# EAGLE design touch_controller (EAGLE 8.2.2)
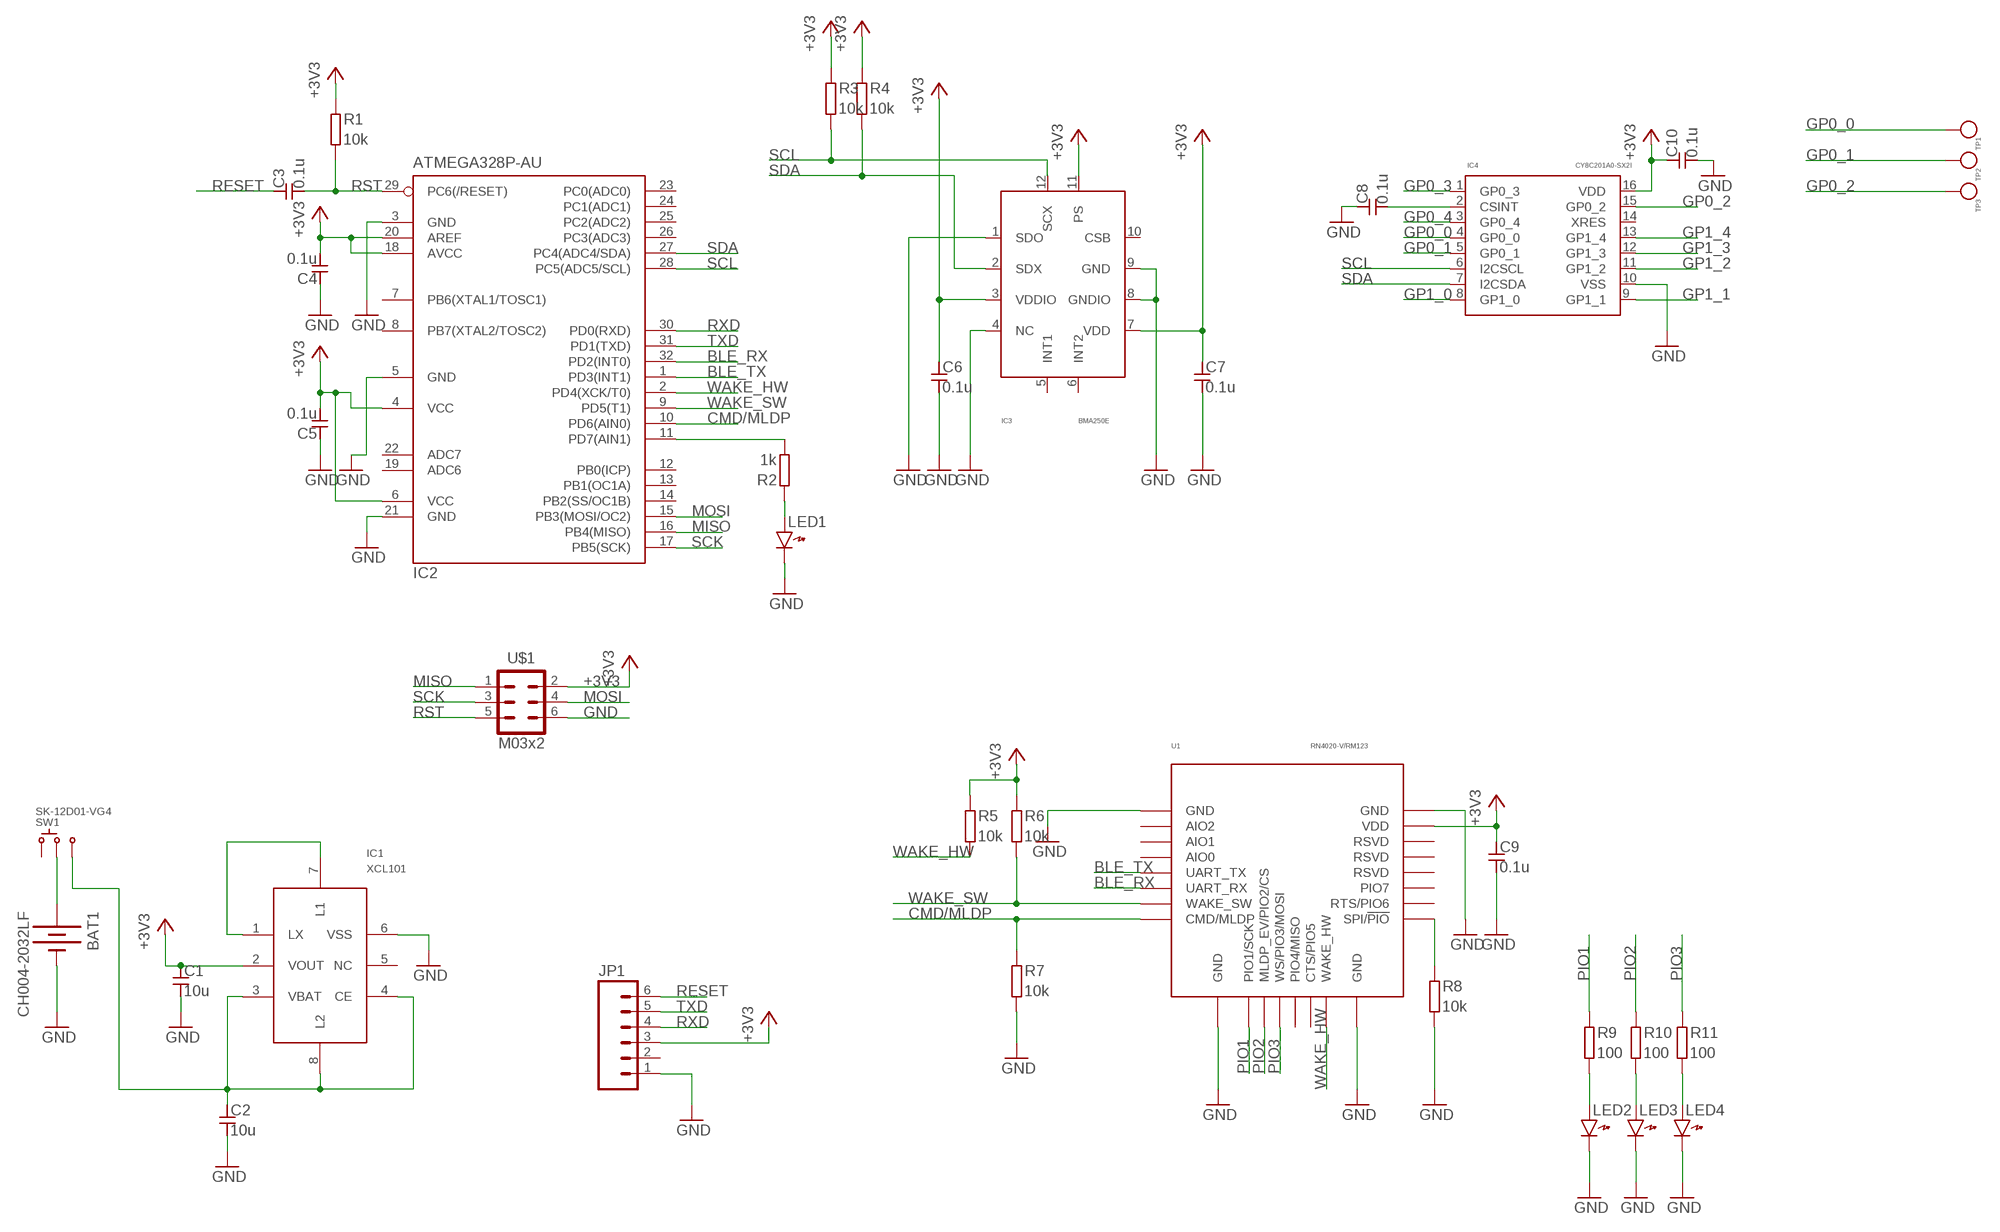
[diagram p0: schematic, sheet 1]

## Parts
BAT1  CH004-2032LF  [CH004-2032LF]
C1  10u  CAPACITOR2012_REDUCED  [SMD2012_REDUCED]
C2  10u  CAPACITOR2012_REDUCED  [SMD2012_REDUCED]
C3  0.1u  CAPACITOR1608_REDUCED  [SMD1608_REDUCED]
C4  0.1u  CAPACITOR1608_REDUCED  [SMD1608_REDUCED]
C5  0.1u  CAPACITOR1608_REDUCED  [SMD1608_REDUCED]
C6  0.1u  CAPACITOR1608_REDUCED  [SMD1608_REDUCED]
C7  0.1u  CAPACITOR1608_REDUCED  [SMD1608_REDUCED]
C8  0.1u  CAPACITOR1608_REDUCED  [SMD1608_REDUCED]
C9  0.1u  CAPACITOR1608_REDUCED  [SMD1608_REDUCED]
C10  0.1u  CAPACITOR1608_REDUCED  [SMD1608_REDUCED]
IC1  XCL101  [CL-2025]
IC2  ATMEGA328P-AU  [TQFP32-08]
IC3  BMA250E  [LGA-12]
IC4  CY8C201A0-SX2I  [SOIC-16]
JP1  M06NOSILK  [1X06-NOSILK]
LED1  LED1608_REDUCED  [LED1608_REDUCED]
LED2  LED1608_REDUCED  [LED1608_REDUCED]
LED3  LED1608_REDUCED  [LED1608_REDUCED]
LED4  LED1608_REDUCED  [LED1608_REDUCED]
R1  10k  RESISTOR1608_REDUCED  [SMD1608_REDUCED]
R2  1k  RESISTOR1608_REDUCED  [SMD1608_REDUCED]
R3  10k  RESISTOR1608_REDUCED  [SMD1608_REDUCED]
R4  10k  RESISTOR1608_REDUCED  [SMD1608_REDUCED]
R5  10k  RESISTOR1608_REDUCED  [SMD1608_REDUCED]
R6  10k  RESISTOR1608_REDUCED  [SMD1608_REDUCED]
R7  10k  RESISTOR1608_REDUCED  [SMD1608_REDUCED]
R8  10k  RESISTOR1608_REDUCED  [SMD1608_REDUCED]
R9  100  RESISTOR1608_REDUCED  [SMD1608_REDUCED]
R10  100  RESISTOR1608_REDUCED  [SMD1608_REDUCED]
R11  100  RESISTOR1608_REDUCED  [SMD1608_REDUCED]
SW1  SK-12D01-VG4  [SK-12D01-VG4]
TP1  HT-0720-10  [HT-0720-10]
TP2  HT-0720-10  [HT-0720-10]
TP3  HT-0720-10  [HT-0720-10]
U1  RN4020-V/RM123  [RN4020]
U$1  M03X2STD  [2X03]

## Nets
+3V3: C1.1 C4.2 C5.2 C6.1 C7.1 C9.1 C10.1 IC1.2(VOUT) IC2.4(VCC) IC2.6(VCC) IC2.18(AVCC) IC2.20(AREF) IC3.3(VDDIO) IC3.7(VDD) IC3.11(PS) IC4.16(VDD) JP1.3 R1.1 R3.1 R4.1 R5.1 R6.1 U1.23(VDD) U$1.2
BLE_RX: IC2.32(PD2(INT0)) U1.6(UART_RX)
BLE_TX: IC2.1(PD3(INT1)) U1.5(UART_TX)
CMD/MLDP: IC2.10(PD6(AIN0)) R7.1 U1.8(CMD/MLDP)
GND: BAT1.- C1.2 C2.2 C4.1 C5.1 C6.2 C7.2 C8.1 C9.2 C10.2 IC1.6(VSS) IC2.3(GND) IC2.5(GND) IC2.21(GND) IC3.1(SDO) IC3.4(NC) IC3.8(GNDIO) IC3.9(GND) IC4.10(VSS) JP1.1 LED1.K LED2.K LED3.K LED4.K R7.2 R8.2 U1.1(GND) U1.9(GND) U1.16(GND) U1.24(GND) U$1.6
GP0_0: IC4.4(GP0_0) TP1.P$1
GP0_1: IC4.5(GP0_1) TP2.P$1
GP0_2: IC4.15(GP0_2) TP3.P$1
GP0_3: IC4.1(GP0_3)
GP0_4: IC4.3(GP0_4)
GP1_0: IC4.8(GP1_0)
GP1_1: IC4.9(GP1_1)
GP1_2: IC4.11(GP1_2)
GP1_3: IC4.12(GP1_3)
GP1_4: IC4.13(GP1_4)
MISO: IC2.16(PB4(MISO)) U$1.1
MOSI: IC2.15(PB3(MOSI/OC2)) U$1.4
N$1: BAT1.+ SW1.2
N$2: C8.2 IC4.2(CSINT)
N$12: R8.1 U1.17(SPI/!PIO)
N$13: IC2.11(PD7(AIN1)) R2.2
N$14: LED2.A R9.2
N$15: LED3.A R10.2
N$16: LED4.A R11.2
N$17: LED1.A R2.1
N$18: C2.1 IC1.3(VBAT) IC1.4(CE) IC1.8(L2) SW1.3
N$20: IC1.1(LX) IC1.7(L1)
PIO1: R9.1 U1.10(PIO1/SCK)
PIO2: R10.1 U1.11(MLDP_EV/PIO2/CS)
PIO3: R11.1 U1.12(WS/PIO3/MOSI)
RESET: C3.1 JP1.6
RST: C3.2 IC2.29(PC6(/RESET)) R1.2 U$1.5
RXD: IC2.30(PD0(RXD)) JP1.4
SCK: IC2.17(PB5(SCK)) U$1.3
SCL: IC2.28(PC5(ADC5/SCL)) IC3.12(SCX) IC4.6(I2CSCL) R3.2
SDA: IC2.27(PC4(ADC4/SDA)) IC3.2(SDX) IC4.7(I2CSDA) R4.2
TXD: IC2.31(PD1(TXD)) JP1.5
WAKE_HW: IC2.2(PD4(XCK/T0)) R5.2 U1.15(WAKE_HW)
WAKE_SW: IC2.9(PD5(T1)) R6.2 U1.7(WAKE_SW)
Unconnected: IC1.5(NC) IC2.7(PB6(XTAL1/TOSC1)) IC2.8(PB7(XTAL2/TOSC2)) IC2.12(PB0(ICP)) IC2.13(PB1(OC1A)) IC2.14(PB2(SS/OC1B)) IC2.19(ADC6) IC2.22(ADC7) IC2.23(PC0(ADC0)) IC2.24(PC1(ADC1)) IC2.25(PC2(ADC2)) IC2.26(PC3(ADC3)) IC3.5(INT1) IC3.6(INT2) IC3.10(CSB) IC4.14(XRES) JP1.2 SW1.1 U1.2(AIO2) U1.3(AIO1) U1.4(AIO0) U1.13(PIO4/MISO) U1.14(CTS/PIO5) U1.18(RTS/PIO6) U1.19(PIO7) U1.20(RSVD) U1.21(RSVD) U1.22(RSVD)

## Library data of the parts
BAT1 = battery:CH004-2032LF: CR2032 x 1 akizuki : P-11255
C1-C10 = generic:CAPACITOR: Generic Capacitor
IC1 = DCDC:XCL101
IC2 = AVR:ATMEGA328P-AU: AVR ATMEGA328P-AU AKIZUKI CODE I-04386
IC3 = acceleration_sensor:BMA250E: Bosch Triaxial Acceleraration Sensor 2g,4g,8g,16g 3-wire,4-wire,I2C,SPI 1.2V ~ 3.6V
IC4 = touch_sensor:CY8C201A0: Cypress touch sensor
JP1 = header:M06
LED1-LED4 = generic:LED: Generic LEDs
R1-R11 = generic:RESISTOR: Generic Registor
SW1 = switch:SK-12D01-VG4: Slide switch ON-(ON) akizuki: P-08789
TP1-TP3 = test_pin:HT-0720-10
U1 = com_module:RN4020: Bluetooth Low Energy Module Microchip
U$1 = header:M03X2

## Board
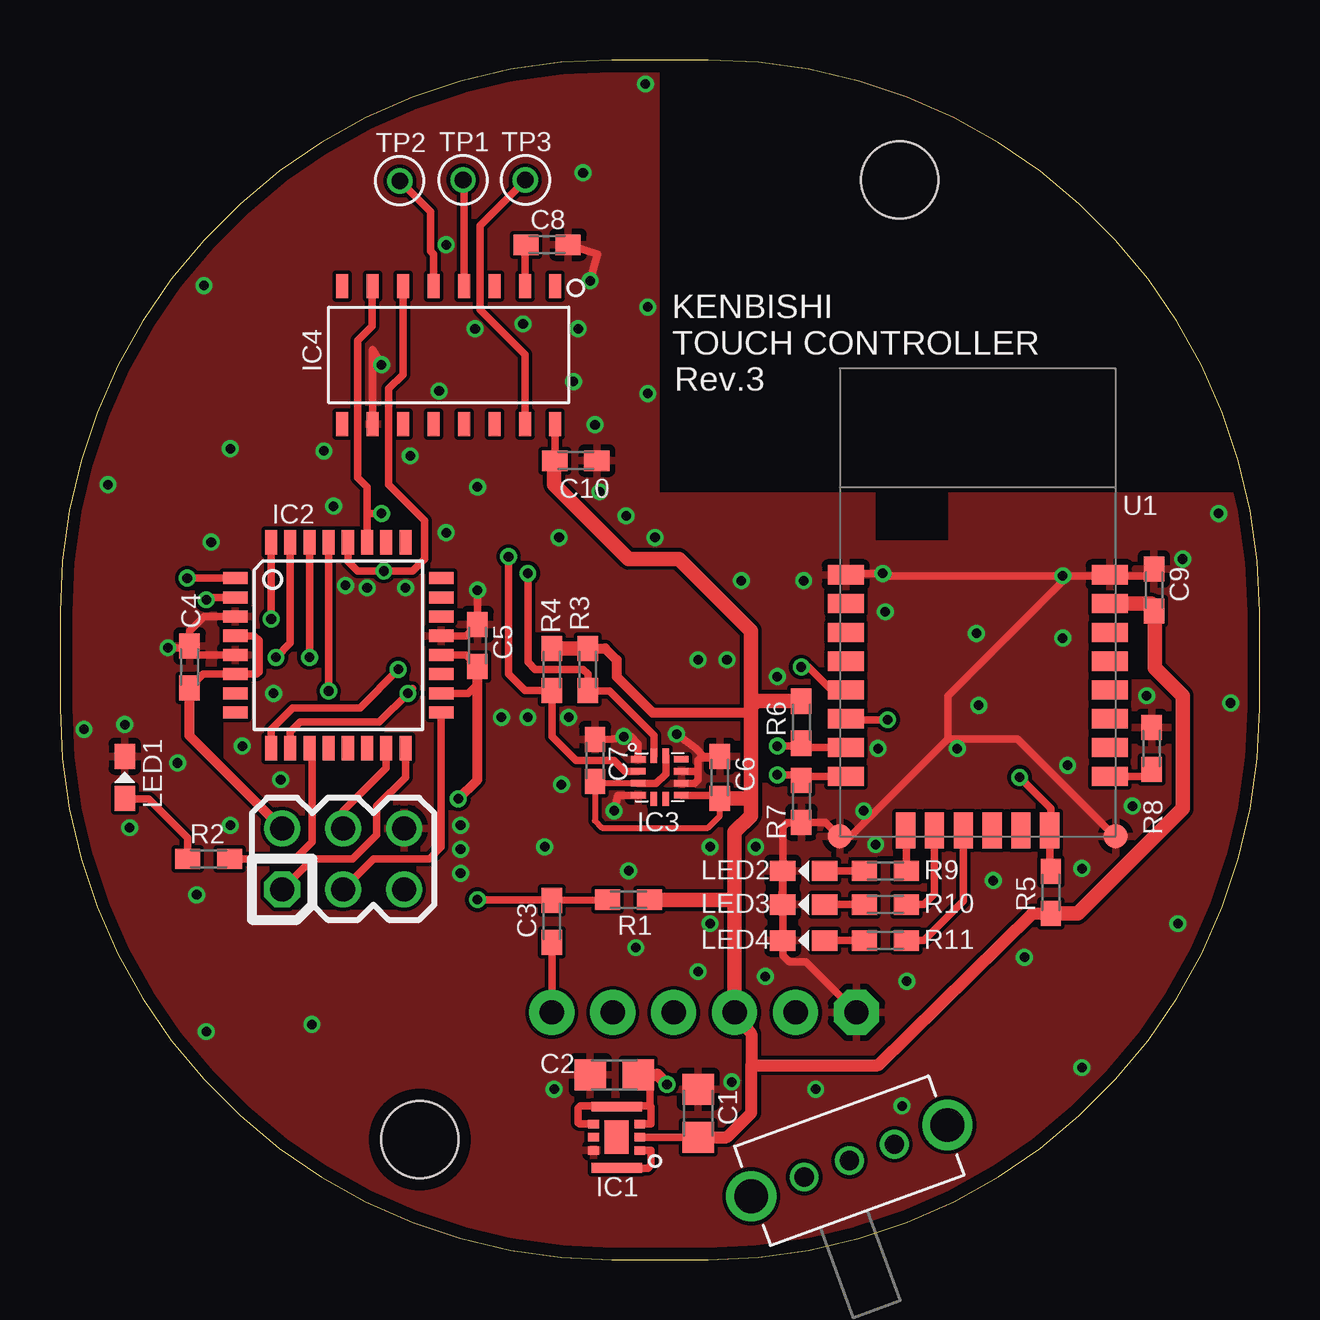
[diagram p1: board, top side]
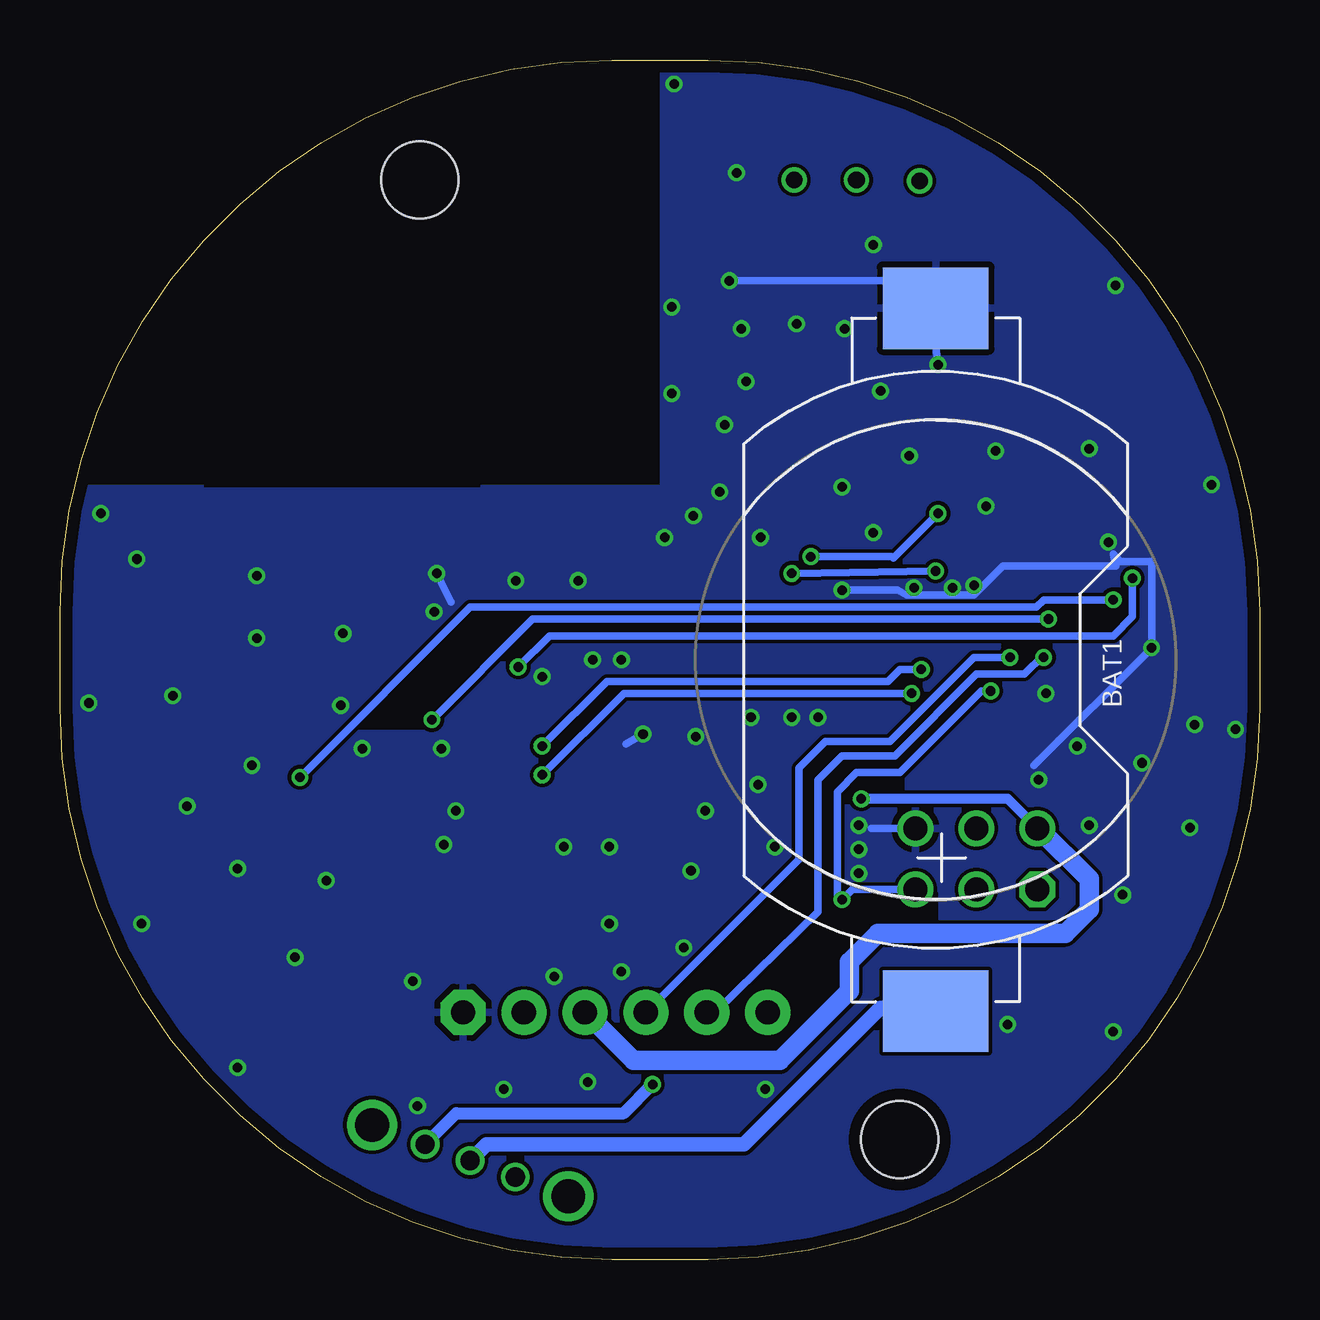
[diagram p2: board, bottom side, seen from below]

Size 50 x 50 mm. Coordinates in mm from the lower left corner, seen from the top.
Outline: 0,27 0,23 arc90 23,0 27,0 arc90 50,23 50,27 arc90 27,50 23,50 arc90 0,27
Copper layers (1*16): Top 0.035mm / dielectric 1.6mm / Bottom 0.035mm
Design rules "Elecrow_2-layer_PCB_eagle_rule": minimum track width 6mil, minimum drill 12mil, track to track 6mil, track to pad 6mil, pad to pad 6mil, via to via 8mil, smd to smd 0mil, copper to edge 20mil, drill to drill 10mil, minimum pad ring 6mil, minimum via ring 6mil, stop-mask expansion 0mil, vias tented up to drill 100mil, thermal gap 10mil
Holes 3.2 mm at 35,45 15,5
tRestrict: area 25,32 to 58,50; area 34,30 to 37,32; area 44.5,24.2 to 45.5,24.3; area 34.1,16.6 to 34.6,16.8; area 34.2,12.8 to 34.6,12.9; area 21,23.1 to 21.5,23.2; area 6.6,21.1 to 6.8,22.4; area 24.5,18.2 to 24.6,18.8; area 9.7,14.6 to 14.2,14.7; area 12.8,34 to 13.2,34.3; area 14,18.8 to 14.8,18.9
bRestrict: area 25,32.3 to 57.9,49.9; area 17.6,14.5 to 18.3,14.6; area 34.7,22.8 to 34.9,24.8; area 34.7,22.1 to 37.4,22.2; area 13.4,14.1 to 13.5,15.3; area 14.8,19.6 to 15,20

### Footprints (pad centres in the part's own frame; a part is rotated, then mirrored left to right if it is on the bottom)
CH004-2032LF = smd 3.4 x 4.4: + -14.65,0; - 14.65,0
SMD2012_REDUCED = smd 1.3 x 1.3: 1 -1,0; 2 1,0
SMD1608_REDUCED = smd 1.05 x 0.85: 1 -0.875,0; 2 0.875,0
CL-2025 = smd 0.35 x 0.44: 1 -0.55,-0.96; 2 0,-0.96; 3 0.55,-0.96; 4 0.55,0.96; 5 0,0.96; 6 -0.55,0.96 | smd 0.4 x 2.1: 7 -1.275,0; 8 1.275,0 | smd 1.4 x 1: P$1 0,0
TQFP32-08 = smd 1.016 x 0.508: 1 -4.293,2.8; 2 -4.293,2; 3 -4.293,1.2; 4 -4.293,0.4; 5 -4.293,-0.4; 6 -4.293,-1.2; 7 -4.293,-2; 8 -4.293,-2.8; 17 4.293,-2.8; 18 4.293,-2; 19 4.293,-1.2; 20 4.293,-0.4; 21 4.293,0.4; 22 4.293,1.2; 23 4.293,2; 24 4.293,2.8 | smd 0.508 x 1.016: 9 -2.8,-4.293; 10 -2,-4.293; 11 -1.2,-4.293; 12 -0.4,-4.293; 13 0.4,-4.293; 14 1.2,-4.293; 15 2,-4.293; 16 2.8,-4.293; 25 2.8,4.293; 26 2,4.293; 27 1.2,4.293; 28 0.4,4.293; 29 -0.4,4.293; 30 -1.2,4.293; 31 -2,4.293; 32 -2.8,4.293
LGA-12 = smd 0.6 x 0.28: 1 -0.9,0.75; 2 -0.9,0.25; 3 -0.9,-0.25; 4 -0.9,-0.75; 7 0.9,-0.75; 8 0.9,-0.25; 9 0.9,0.25; 10 0.9,0.75 | smd 0.28 x 0.6: 5 -0.25,-0.9; 6 0.25,-0.9; 11 0.25,0.9; 12 -0.25,0.9
SOIC-16 = smd 0.5 x 1: 1 -4.445,-2.875; 2 -3.175,-2.875; 3 -1.905,-2.875; 4 -0.635,-2.875; 5 0.635,-2.875; 6 1.905,-2.875; 7 3.175,-2.875; 8 4.445,-2.875; 9 4.445,2.875; 10 3.175,2.875; 11 1.905,2.875; 12 0.635,2.875; 13 -0.635,2.875; 14 -1.905,2.875; 15 -3.175,2.875; 16 -4.445,2.875
1X06-NOSILK = drill 1.016 pad 1.88 octagon: 1 0,0 | drill 1.016 pad 1.88: 2 2.54,0; 3 5.08,0; 4 7.62,0; 5 10.16,0; 6 12.7,0
LED1608_REDUCED = smd 1.05 x 0.85: A -0.875,0; K 0.875,0
SK-12D01-VG4 = drill 0.8: 1 -2,0; 2 0,0; 3 2,0 | drill 1.4: 4 4.35,0; 5 -4.35,0
HT-0720-10 = drill 0.7: P$1 0,0
RN4020 = smd 1.5 x 0.8: 1 0.25,10.9; 2 0.25,9.7; 3 0.25,8.5; 4 0.25,7.3; 5 0.25,6.1; 6 0.25,4.9; 7 0.25,3.7; 8 0.25,2.5; 17 11.25,2.5; 18 11.25,3.7; 19 11.25,4.9; 20 11.25,6.1; 21 11.25,7.3; 22 11.25,8.5; 23 11.25,9.7; 24 11.25,10.9 | smd 1 x 1: 9 0,0; 16 11.5,0 | smd 0.8 x 1.5: 10 2.75,0.25; 11 3.95,0.25; 12 5.15,0.25; 13 6.35,0.25; 14 7.55,0.25; 15 8.75,0.25
2X03 = drill 1 octagon: 1 -1.27,2.54 | drill 1: 2 1.27,2.54; 3 -1.27,0; 4 1.27,0; 5 -1.27,-2.54; 6 1.27,-2.54

### Placement (x,y rotation side)
BAT1  13.5,25 90 bottom
C1  26.6,6.1 90 top
C2  23.1,7.7 180 top
C3  20.5,14.1 90 top
C4  5.4,24.7 270 top
C5  17.4,25.6 270 top
C6  27.5,20.1 90 top
C7  22.3,20.8 90 top
C8  20.3,42.3 180 top
C9  45.6,27.91 90 top
C10  21.5,33.3 0 top
IC1  23.2,5.1 90 top
IC2  11.6,25.6 0 top
IC3  25,20.1 0 top
IC4  16.2,37.7 180 top
JP1  33.2,10.3 180 top
LED1  2.7,20.1 90 top
LED2  31,16.2 180 top
LED3  31,14.8 180 top
LED4  31,13.3 180 top
R1  23.7,15 180 top
R2  6.2,16.7 0 top
R3  22,24.6 270 top
R4  20.5,24.6 270 top
R5  41.3,15.3 90 top
R6  30.9,22.4 270 top
R7  30.9,19.1 270 top
R8  45.5,21.3 90 top
R9  34.4,16.2 180 top
R10  34.4,14.8 180 top
R11  34.4,13.3 180 top
SW1  32.9,4.12 20 top
TP1  16.8,45 0 top
TP2  14.16,44.96 0 top
TP3  19.4,45 0 top
U1  32.5,17.64 0 top
U$1  11.8,16.7 90 top

### Tracks (layer width: path | path; a pad name or v marks a point on that pad's centre or on a via)
+3V3  (via drill 0.4)
  Top 0.254: IC3.3 22.38,19.85 C7.1 22.3,18.3 22.6,18 27,18 27.5,18.5 C6.1
  Top 0.305: 43.77,27.34 U1.23 | 45.63,27 C9.1 | IC3.7 27.18,19.35 C6.1 | IC3.11 25.25,20.25 24.85,19.85 IC3.3 | C4.2 5.97,24.4 IC2.6 8.2,24.4 8.3,24.5 8.3,25.8 8.1,26 IC2.4 | IC2.20 16.93,25.2 C5.2 17.4,24 17,23.6 IC2.18 | 28.1,10.48 JP1.3 | 20.91,33.09 arc45 C10.1 20.64,33.32 IC4.16 | IC1.2 C1.1
  Top 0.406: R3.1 22.73,25.48 23.2,25 23.2,24.3 24.7,22.8 28.75,22.8 28.8,22.75 | U$1.2 5.4,21.83 C4.2 | v16.6,19.2 17.4,20 C5.2
  Top 0.508: 28.82,8.1 34.1,8.1 40.52,14.43 R5.1 | JP1.3 28.82,9.4 28.82,8.1 | C1.1 27.8,5.1 28.82,6.12 28.82,8.1
  Top 0.61: R5.1 42.42,14.43 46.8,18.8 46.8,23.5 45.63,24.66 45.63,27 | 43.8,27.3 43.77,27.34 | C9.1 45.49,27.34 U1.23 | R4.1 R3.1 | 30.88,23.3 R6.1 29.02,23.27 28.8,23.05 | 28.12,14.92 JP1.3 | 28.12,14.92 28.12,17.82 28.8,18.5 28.8,19.75 | 28.8,19.75 28.8,22.75 28.8,23.05 | 28.8,23.05 28.8,26.2 25.8,29.2 23.7,29.2 20.6,32.3 20.6,33.27 C10.1 | C6.1 28.78,19.23 28.8,19.75 | R1.1 28.04,15 28.12,14.92
  Bottom 0.305: JP1.3 28.12,10.12 | 9.23,18 U$1.2
  Bottom 0.406: U$1.2 10.49,19.2 v16.6,19.2
  Bottom 0.813: JP1.3 28.1,10.3 26.1,8.3 20,8.3 17.1,11.2 17.1,12.4 15.9,13.6 8.1,13.6 7.1,14.6 7.1,15.87 9.23,18
BLE_RX  (via drill 0.4)
  Top 0.305: v34.5,22.5 32.79,22.5 U1.6 | IC2.32 v8.8,26.7
  Bottom 0.305: v8.8,26.7 30.3,26.7 v34.5,22.5
BLE_TX  (via drill 0.4)
  Top 0.305: v30.9,24.7 31.2,24.7 32.2,23.7 32.71,23.7 U1.5 | IC2.1 v5.3,28.4
  Bottom 0.305: v5.3,28.4 5.3,26.8 6.1,26 29.6,26 v30.9,24.7
CMD/MLDP  (via drill 0.4)
  Top 0.305: U1.8 31.07,20.14 R7.1 | 30.88,19.6 R7.1 | IC2.10 9.6,22 10,22.4 13.3,22.4 v14.5,23.6 14.7,23.8 | R7.1 30.7,20.2 v29.9,20.2
  Bottom 0.305: v14.5,23.6 26.5,23.6 v29.9,20.2
GND  (via drill 0.4)
  Top 0.305: C9.2 45.59,28.48 44.7,28.5 43.79,28.5 U1.24 43.71,28.5 42,28.5 | LED2.K LED3.K LED4.K 30.12,12.68 30.4,12.4 31.1,12.4 JP1.1 | IC3.8 26.45,19.85 26.6,20 26.6,20.27 | 26.6,20.27 26.6,20.8 26.7,20.9 27.23,20.9 C6.2 26.8,21 26.5,21.3 v25.7,21.9 | IC3.9 26.52,20.35 26.6,20.27 | R7.2 30.88,17.9 30.9,17.9 R7.2 | 30.1,15.3 30.1,14.43 LED2.K | 32.36,17.64 U1.9 | R7.2 31.91,18.23 U1.9 | IC2.5 5.78,25.2 C4.1 | IC2.21 16.93,26 C5.1 v17.4,27.9 | IC2.3 6,26.8 5.4,26.2 C4.1 | IC3.1 24.1,21.5 23.8,21.8 23.02,21.7 C7.2 | IC3.4 23.25,19.35 v23.1,18.7 | U1.1 32.81,28.6 v34.3,28.6 34.4,28.5 v41.8,28.5 42,28.5 | U1.9 32.94,17.64 37,21.7 | 37,21.7 37,23.5 42,28.5 | U1.16 43.96,17.64 39.9,21.7 37,21.7 | LED2.K 30.12,18.02 30.3,18.2 30.88,18.2 R7.2 | IC4.10 13.03,37.92 v13.4,37.3 | C8.1 22.4,41.9 v22.1,40.8 | v4.5,25.5 5.33,25.5 C4.1
  Bottom 0.305: 33.7,27.4 v34.3,28.6 | v13.4,37.3 13.7,39.9 13.6,40 13.6,40.65 13.53,40.72 | 13.53,40.72 BAT1.- | v22.1,40.8 14.71,40.8 13.53,40.72 | v17.4,27.9 15.1,27.9 14.7,27.7 11.9,27.7 10.7,28.9 6,28.9 6.1,29.4 5.8,29.1 4.5,29.1 v4.5,25.5 9.4,20.6 | U$1.6 16.17,17.97 | v25.7,21.9 26.4,21.5
  other vias: 24.4,49 22.3,34.8 44.7,18.9 23.5,21.8 45.3,23.5 16.7,18.1 16.7,17.1 16.7,16.1 8.9,23.6 11.9,28.1 12.8,28 14.4,28 21.2,22.6 19.5,22.6 18.4,22.6 20.9,19.8 20.2,17.2 23.7,16.2 27.1,17.2 29,17.2 29.9,24.3 34.1,21.3 33.5,18.7 34,17.3 37.4,21.3 38.3,23.1 38.2,26.1 34.4,27 41.8,25.9 42,20.6 42.6,16.3 38.9,15.8 35.3,11.6 40.2,12.6 42.6,8 29.4,11.8 26.6,12 27.1,14 24,13 31,28.3 28.4,28.3 24.8,30.1 23.6,31 22.5,32 24.5,36.1 21.4,36.6 21.6,38.8 24.5,39.7 19.3,39 15.8,36.2 17.4,32.2 14.6,33.5 21.8,45.3 16.1,42.3 11,33.7 7.1,33.8 6,40.6 2,32.3 1,22.1 7.6,21.4 9.2,20 7.1,18.1 2.7,22.3 6.1,9.5 10.5,9.8 20.6,7.1 28,7.4 31.5,7.1 35.1,6.4 46.6,14 48.8,23.2 48.3,31.1 6.3,29.9 11.4,31.4 16.1,30.3 4.9,20.7 20.8,30.1 26.6,25 27.8,25 2.9,18 17.3,38.8 5.7,15.2 46.8,29.2
  pour Bottom: 0,0 50,0 50,50 0,50
  pour Top: 0,0 50,0 50,50 0,50
GP0_0
  Top 0.305: IC4.4 16.84,44.97 TP1.P$1
GP0_1
  Top 0.305: IC4.5 15.56,41.91 15.44,42.03 15.44,43.68 TP2.P$1
GP0_2
  Top 0.305: IC4.15 19.38,37.73 17.5,39.6 17.5,43.1 TP3.P$1
MISO
  Top 0.305: IC2.16 14.4,20.1 13.2,18.9 13.2,17.7 12.2,16.7 10.53,16.7 U$1.1
MOSI
  Top 0.305: IC2.15 13.6,20.5 11.8,18.7 U$1.4
N$1
  Bottom 0.61: SW1.2 32.23,4.8 21.5,4.8 15.8,10.5 14.1,10.5 14,10.4 13.55,10.4 BAT1.+
N$2
  Top 0.305: 19.38,40.75 IC4.2 19.38,41.85 C8.2
N$12
  Top 0.305: U1.17 45.44,20.14 R8.1
N$13
  Top 0.305: IC2.11 10.4,21 10.5,20.9 10.5,17.4 9.8,16.7 R2.2
N$14
  Top 0.305: LED2.A R9.2
N$15
  Top 0.305: R10.2 LED3.A
N$16
  Top 0.305: LED4.A R11.2
N$17
  Top 0.305: R2.1 5.33,17.57 3.7,19.2 2.92,19.2 LED1.A
N$18  (via drill 0.4)
  Top 0.305: 24.6,6.4 23.23,6.4 IC1.8 23.18,6.4 21.7,6.4 21.6,6.3 21.6,5.7 21.65,5.65 IC1.4 | IC1.3 24.64,5.65 24.64,6.36 24.6,6.4 | 24.6,6.4 24.6,7.6 C2.1
  Top 0.508: v25.3,7.3 24.9,7.7 C2.1
  Bottom 0.508: SW1.3 33.49,6.1 26.5,6.1 v25.3,7.3
N$20
  Top 0.305: IC1.1 24.64,4.55 24.64,3.94 24.5,3.8 23.23,3.8 IC1.7
PIO1
  Top 0.305: U1.10 35.27,17.86 R9.1
PIO2
  Top 0.305: U1.11 36.45,15.25 36,14.8 R10.1
PIO3
  Top 0.305: U1.12 37.65,14.95 36,13.3 R11.1
RESET
  Top 0.305: JP1.6 C3.1
RST  (via drill 0.4)
  Top 0.305: C3.2 R1.2 | 20.6,15.07 C3.2 | v17.4,15 20.48,15 C3.2 | v11.2,23.7 IC2.29
  Bottom 0.305: U$1.5 16.97,15.43 v17.4,15 17.6,15.2 17.6,19.5 16.8,20.3 15,20.3 11.6,23.7 v11.2,23.7
RXD  (via drill 0.4)
  Top 0.305: IC2.30 v10.4,25.1
  Bottom 0.305: v10.4,25.1 11.9,25.1 15.4,21.6 18.1,21.6 19.2,20.5 19.2,16.68 JP1.4 25.6,10.32
SCK
  Top 0.305: IC2.17 15.89,17.19 15.4,16.7 13.07,16.7 U$1.3
SCL  (via drill 0.4)
  Top 0.305: IC2.28 12,29.1 12.4,28.7 v13.5,28.7 14.7,28.7 15.2,29.2 15.2,30.8 13.7,32.3 13.7,36.3 14.29,36.9 IC4.6 | 19.5,28.7 v19.5,28.6 19.5,24.9 19.8,24.6 21.8,24.6 22,24.4 R3.2 22.02,23.7 22.9,23.7 24.75,21.85 IC3.12
  Bottom 0.305: v19.5,28.6 v13.5,28.7
SDA  (via drill 0.4)
  Top 0.305: 12.8,31.09 IC2.27 | 12.8,31.09 12.8,32.2 12.4,32.6 12.4,38.3 13,38.9 13,40.55 IC4.7 | v13.4,31.1 12.8,31.1 12.8,31.09 | IC3.2 23.55,20.35 23.1,20.8 21.5,20.8 20.5,21.8 R4.2 19.38,23.73 18.7,24.4 v18.7,29.3
  Bottom 0.305: v13.4,31.1 15.27,29.23 15.34,29.3 v18.7,29.3
TXD  (via drill 0.4)
  Top 0.305: IC2.31 9.6,25.7 v9,25.1
  Bottom 0.305: v9,25.1 9,25.2 9.8,24.4 11.8,24.4 15.2,21 17.4,21 18.4,20 18.4,14.5 22.66,10.34 23,10.34 JP1.5
WAKE_HW  (via drill 0.4)
  Top 0.305: R5.2 41.25,16.23 U1.15 41.3,17.94 41.3,18.8 v40,20.1 | IC2.2 6.3,27.6 v6.1,27.5
  Bottom 0.305: v6.1,27.5 9,27.5 9.3,27.2 32.9,27.2 v40,20.1
WAKE_SW  (via drill 0.4)
  Top 0.305: U1.7 31.09,21.34 R6.2 | R6.2 30.77,21.4 v29.9,21.4 | 30.88,21.5 R6.2 | IC2.9 8.8,22.1 9.7,23 12.5,23 v14.1,24.6
  Bottom 0.305: v14.1,24.6 15,24.6 15.5,24.1 27.2,24.1 v29.9,21.4

### Text on the board
tPlace: KENBISHI / TOUCH CONTROLLER | Rev.3